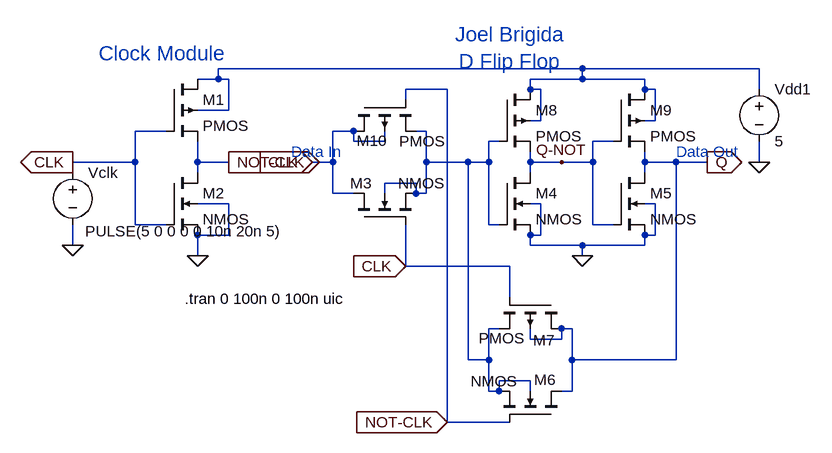
[diagram p0: schematic D-FlipFlop.asc]
D-FlipFlop.asc, the LTspice schematic file:
Version 4
SHEET 1 880 680
WIRE 256 -48 -304 -48
WIRE 528 -48 256 -48
WIRE -304 -32 -304 -48
WIRE -304 -32 -336 -32
WIRE -288 -32 -304 -32
WIRE 256 -32 256 -48
WIRE 256 -32 176 -32
WIRE 352 -32 256 -32
WIRE 48 -16 -16 -16
WIRE 176 -16 176 -32
WIRE 192 -16 176 -16
WIRE 352 -16 352 -32
WIRE 368 -16 352 -16
WIRE 528 -16 528 -48
WIRE -16 0 -16 -16
WIRE -288 16 -288 -32
WIRE -288 16 -336 16
WIRE 192 32 192 -16
WIRE 192 32 176 32
WIRE 368 32 368 -16
WIRE 368 32 352 32
WIRE -384 48 -432 48
WIRE -96 48 -128 48
WIRE 16 48 0 48
WIRE -96 64 -96 48
WIRE -48 64 -48 48
WIRE -48 64 -96 64
WIRE 128 64 112 64
WIRE 304 64 272 64
WIRE -432 96 -432 48
WIRE -432 96 -528 96
WIRE -336 96 -336 64
WIRE -288 96 -336 96
WIRE -128 96 -128 48
WIRE -128 96 -160 96
WIRE 16 96 16 48
WIRE 80 96 16 96
WIRE 112 96 112 64
WIRE 112 96 80 96
WIRE 176 96 176 80
WIRE 224 96 176 96
WIRE 272 96 272 64
WIRE 272 96 224 96
WIRE 352 96 352 80
WIRE 400 96 352 96
WIRE 448 96 400 96
WIRE 528 96 528 64
WIRE -528 112 -528 96
WIRE -336 112 -336 96
WIRE 176 112 176 96
WIRE 352 112 352 96
WIRE 0 128 -48 128
WIRE -128 144 -128 96
WIRE -96 144 -128 144
WIRE -48 144 -48 128
WIRE 0 144 0 128
WIRE 16 144 16 96
WIRE 16 144 0 144
WIRE -288 160 -336 160
WIRE 192 160 176 160
WIRE 368 160 352 160
WIRE -432 192 -432 96
WIRE -384 192 -432 192
WIRE 112 192 112 96
WIRE 128 192 112 192
WIRE 272 192 272 96
WIRE 304 192 272 192
WIRE -288 208 -288 160
WIRE -288 208 -336 208
WIRE 192 208 192 160
WIRE 192 208 176 208
WIRE 368 208 368 160
WIRE 368 208 352 208
WIRE -528 224 -528 192
WIRE 176 224 176 208
WIRE 256 224 176 224
WIRE 352 224 352 208
WIRE 352 224 256 224
WIRE -336 240 -336 208
WIRE 256 240 256 224
WIRE -16 256 -16 192
WIRE 144 256 -16 256
WIRE 144 304 144 256
WIRE 128 352 112 352
WIRE 240 352 224 352
WIRE 176 368 176 352
WIRE 224 368 224 352
WIRE 224 368 176 368
WIRE 80 400 80 96
WIRE 112 400 112 352
WIRE 112 400 80 400
WIRE 240 400 240 352
WIRE 400 400 400 96
WIRE 400 400 240 400
WIRE 176 432 128 432
WIRE 112 448 112 400
WIRE 128 448 128 432
WIRE 128 448 112 448
WIRE 176 448 176 432
WIRE 240 448 240 400
WIRE 240 448 224 448
WIRE 48 496 48 -16
WIRE 144 496 48 496
FLAG -336 240 0
FLAG 256 240 0
FLAG 448 96 Q
IOPIN 448 96 Out
FLAG 224 96 Q-NOT
FLAG 528 96 0
FLAG -16 256 CLK
IOPIN -16 256 In
FLAG -528 224 0
FLAG -528 96 CLK
IOPIN -528 96 Out
FLAG -288 96 NOT-CLK
IOPIN -288 96 Out
FLAG 48 496 NOT-CLK
IOPIN 48 496 In
FLAG -160 96 CLK
IOPIN -160 96 In
SYMBOL pmos4 -384 -32 R0
SYMATTR InstName M1
SYMBOL nmos4 -384 112 R0
SYMATTR InstName M2
SYMBOL nmos4 -96 192 R270
WINDOW 0 64 -5 VRight 2
WINDOW 3 64 69 VRight 2
SYMATTR InstName M3
SYMBOL nmos4 128 112 R0
SYMATTR InstName M4
SYMBOL nmos4 304 112 R0
SYMATTR InstName M5
SYMBOL nmos4 224 496 M270
WINDOW 0 65 8 VRight 2
WINDOW 3 63 68 VRight 2
SYMATTR InstName M6
SYMBOL pmos4 224 304 R90
WINDOW 0 66 10 VRight 2
WINDOW 3 63 57 VRight 2
SYMATTR InstName M7
SYMBOL pmos4 128 -16 R0
SYMATTR InstName M8
SYMBOL pmos4 304 -16 R0
SYMATTR InstName M9
SYMBOL pmos4 -96 0 M90
WINDOW 0 63 5 VRight 2
WINDOW 3 64 70 VRight 2
SYMATTR InstName M10
SYMBOL voltage 528 -32 R0
SYMATTR InstName Vdd1
SYMATTR Value 5
SYMBOL voltage -528 96 R0
WINDOW 3 19 106 Left 2
WINDOW 123 0 0 Left 0
WINDOW 39 0 0 Left 0
SYMATTR InstName Vclk
SYMATTR Value PULSE(5 0 0 0 0 10n 20n 5)
TEXT 144 -80 Center 3 ;Joel Brigida\nD Flip Flop
TEXT -488 -72 Left 3 ;Clock Module
TEXT -356 306 Left 2 !.tran 0 100n 0 100n uic
TEXT -192 80 Left 2 ;Data In
TEXT 400 80 Left 2 ;Data Out

The netlist it stands for:
* D-FlipFlop.asc
M1 N001 CLK NOT-CLK N001 PMOS
M2 NOT-CLK CLK 0 0 NMOS
M3 CLK CLK N002 N002 NMOS
M4 Q-NOT N002 0 0 NMOS
M5 Q Q-NOT 0 0 NMOS
M6 Q NOT-CLK N002 N002 NMOS
M7 Q CLK N002 Q PMOS
M8 N001 N002 Q-NOT N001 PMOS
M9 N001 Q-NOT Q N001 PMOS
M10 CLK NOT-CLK N002 CLK PMOS
Vdd1 N001 0 5
Vclk CLK 0 PULSE(5 0 0 0 0 10n 20n 5)
.model NMOS NMOS
.model PMOS PMOS
.lib standard.mos
* Joel Brigida
* D Flip Flop
* Clock Module
.tran 0 100n 0 100n uic
* Data In
* Data Out
.backanno
.end